# EAGLE design annoyatron_revA (EAGLE 6.5.0)

## Sheet 1 of 2
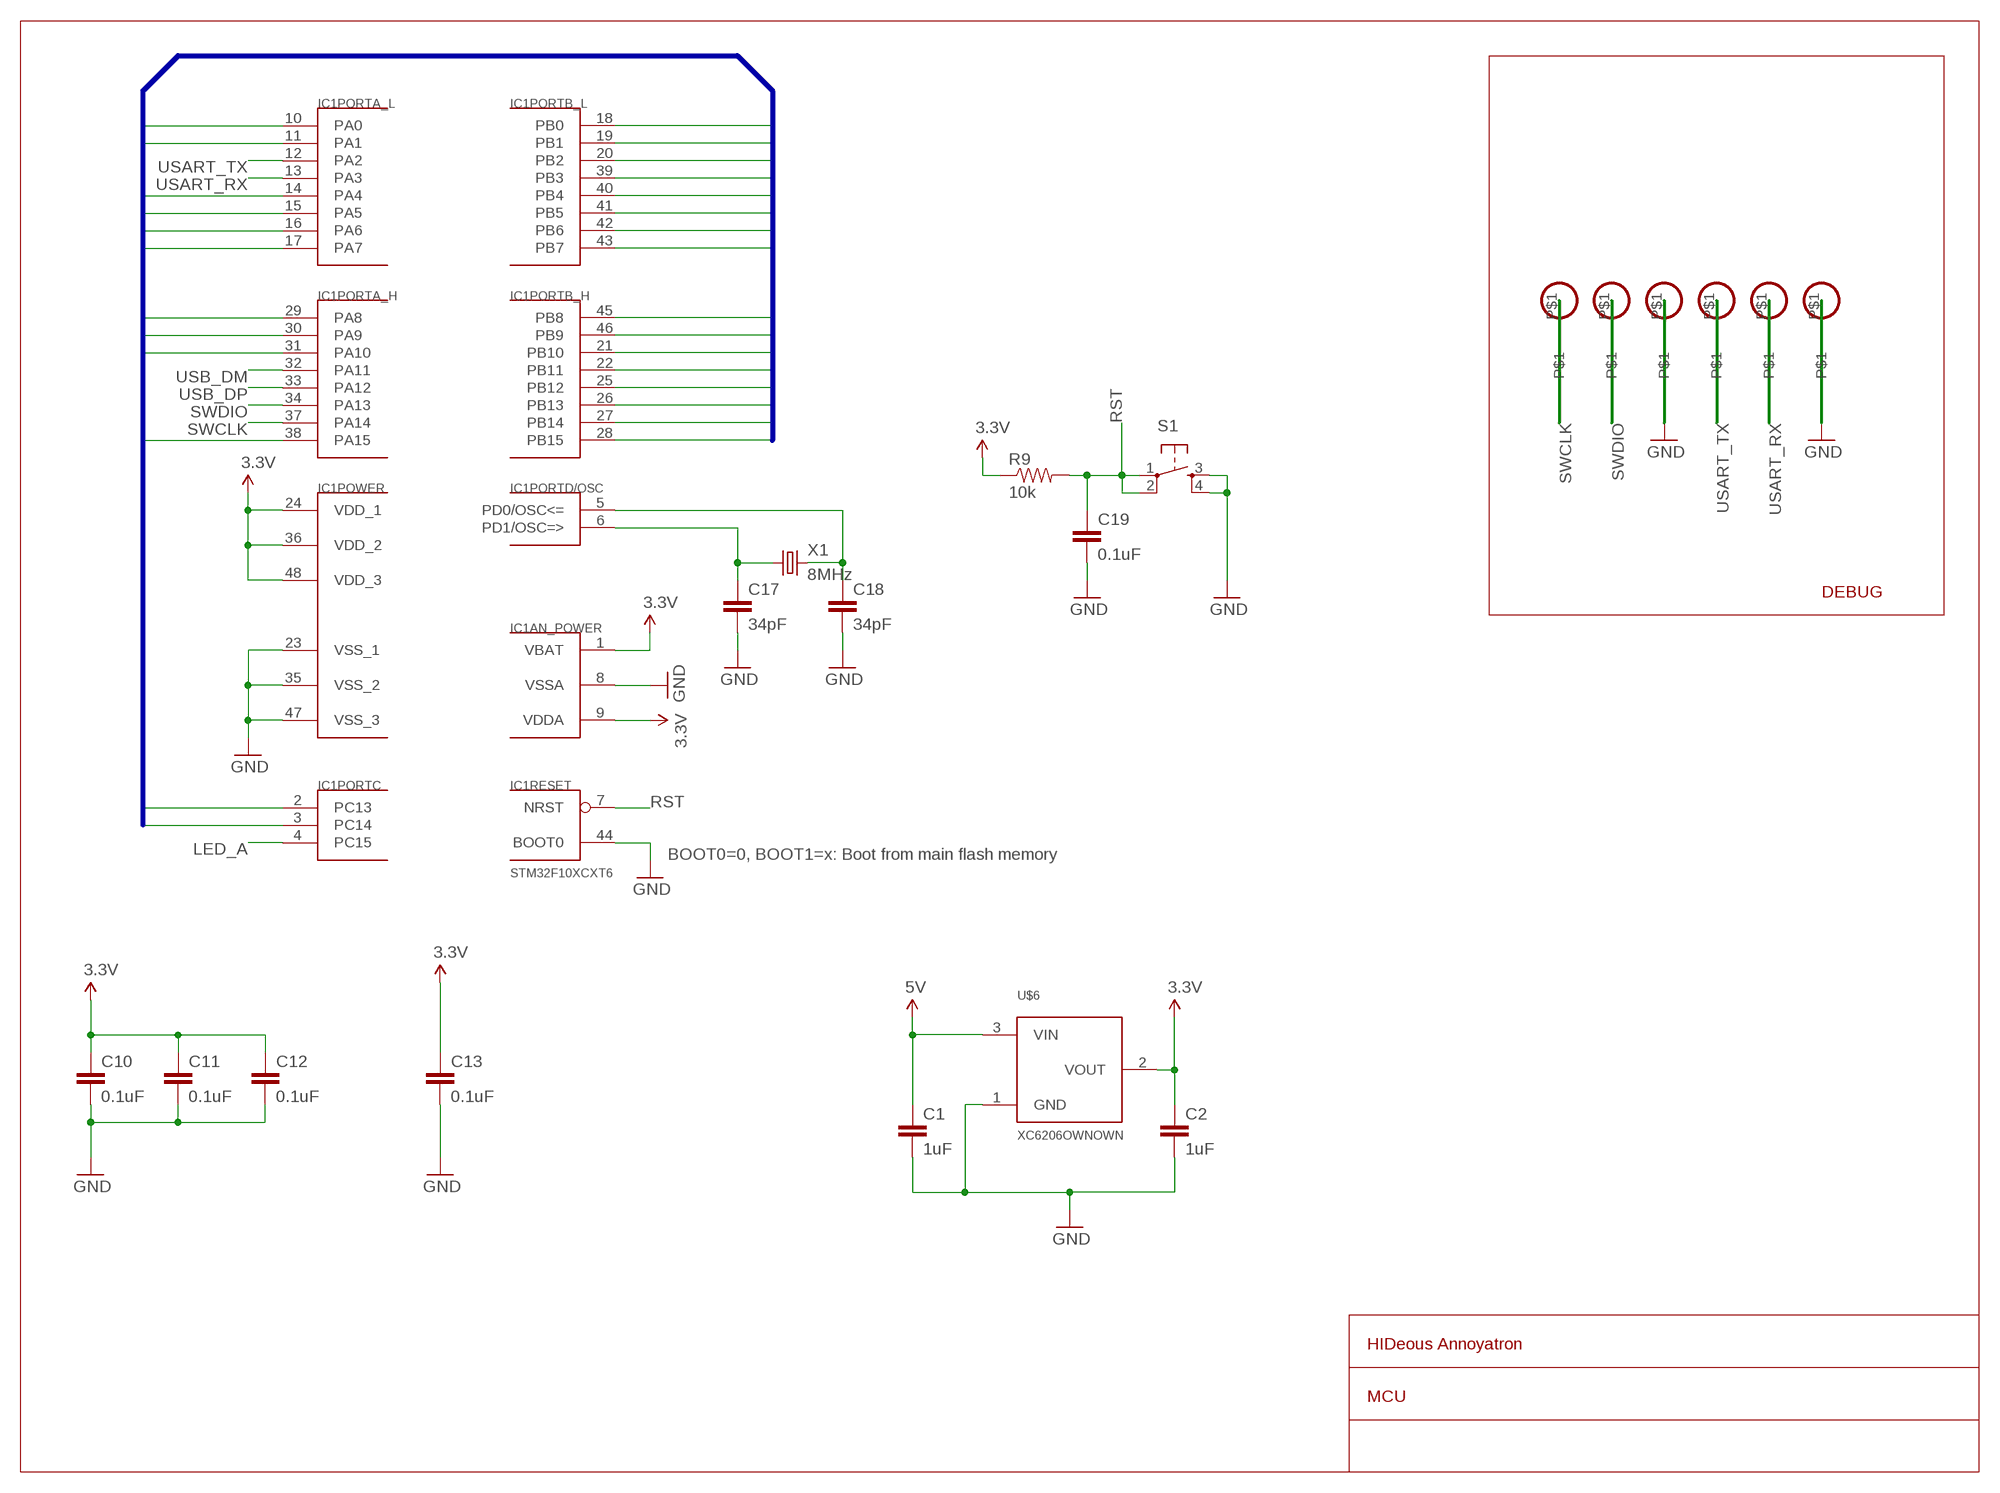
[diagram p0: schematic, sheet 1]

### Parts
C1  1uF  CAP0805  [0805_GEN]
C2  1uF  CAP0805  [0805_GEN]
C10  0.1uF  CAP0402  [C0402]
C11  0.1uF  CAP0402  [C0402]
C12  0.1uF  CAP0402  [C0402]
C13  0.1uF  CAP0402  [C0402]
C17  34pF  CAP0402  [C0402]
C18  34pF  CAP0402  [C0402]
C19  0.1uF  CAP0402  [C0402]
IC1  STM32F10XCXT6  [TQFP48]
R9  10k  RESISTOR0402  [C0402]
S1  TAC_SWITCHSMD  [TACTILE_SWITCH_SMD]
U$2  PADOWN  [PAD2MM]
U$3  PADOWN  [PAD2MM]
U$4  PADOWN  [PAD2MM]
U$5  PADOWN  [PAD2MM]
U$6  XC6206OWNOWN  [SOT23]
U$9  PADOWN  [PAD2MM]
U$10  PADOWN  [PAD2MM]
X1  8MHz  CRYSTALOWN5X3.2_7A  [CRYSTAL_SMD_5X3.2_7A]

### Nets
3.3V: C2.1 C10.1 C11.1 C12.1 C13.1 IC1.1(AN_POWER:VBAT) IC1.9(AN_POWER:VDDA) IC1.24(POWER:VDD_1) IC1.36(POWER:VDD_2) IC1.48(POWER:VDD_3) R9.1 U$6.2(VOUT)
5V: C1.1 U$6.3(VIN) ; also sheet 2
GND: C1.2 C2.2 C10.2 C11.2 C12.2 C13.2 C17.2 C18.2 C19.2 IC1.8(AN_POWER:VSSA) IC1.23(POWER:VSS_1) IC1.35(POWER:VSS_2) IC1.44(RESET:BOOT0) IC1.47(POWER:VSS_3) S1.3 S1.4 U$4.P$1 U$6.1(GND) U$10.P$1 ; also sheet 2
LED_A: IC1.4(PORTC:PC15)
OSCI: C18.1 IC1.5(PORTD/OSC:PD0/OSC<=) X1.P$2
OSCO: C17.1 IC1.6(PORTD/OSC:PD1/OSC=>) X1.P$1
PA0: IC1.10(PORTA_L:PA0)
PA1: IC1.11(PORTA_L:PA1)
PA4: IC1.14(PORTA_L:PA4)
PA5: IC1.15(PORTA_L:PA5)
PA6: IC1.16(PORTA_L:PA6)
PA7: IC1.17(PORTA_L:PA7)
PA8: IC1.29(PORTA_H:PA8) ; also sheet 2
PA9: IC1.30(PORTA_H:PA9)
PA10: IC1.31(PORTA_H:PA10)
PA15: IC1.38(PORTA_H:PA15)
PB0: IC1.18(PORTB_L:PB0)
PB1: IC1.19(PORTB_L:PB1)
PB2: IC1.20(PORTB_L:PB2)
PB3: IC1.39(PORTB_L:PB3)
PB4: IC1.40(PORTB_L:PB4)
PB5: IC1.41(PORTB_L:PB5)
PB6: IC1.42(PORTB_L:PB6)
PB7: IC1.43(PORTB_L:PB7)
PB8: IC1.45(PORTB_H:PB8)
PB9: IC1.46(PORTB_H:PB9)
PB10: IC1.21(PORTB_H:PB10)
PB11: IC1.22(PORTB_H:PB11)
PB12: IC1.25(PORTB_H:PB12)
PB13: IC1.26(PORTB_H:PB13)
PB14: IC1.27(PORTB_H:PB14)
PB15: IC1.28(PORTB_H:PB15)
PC13: IC1.2(PORTC:PC13)
PC14: IC1.3(PORTC:PC14)
RST: C19.1 IC1.7(RESET:NRST) R9.2 S1.1 S1.2
SWCLK: IC1.37(PORTA_H:PA14) U$2.P$1
SWDIO: IC1.34(PORTA_H:PA13) U$3.P$1
USART_RX: IC1.13(PORTA_L:PA3) U$9.P$1
USART_TX: IC1.12(PORTA_L:PA2) U$5.P$1
USB_DM: IC1.32(PORTA_H:PA11) ; also sheet 2
USB_DP: IC1.33(PORTA_H:PA12) ; also sheet 2

### Buses
PA[0..1],PA[4..10],PA15,PB[0..15],PC[13..14]

### Notes on the sheet
- DEBUG
- BOOT0=0, BOOT1=x: Boot from main flash memory
- HIDeous Annoyatron
- MCU

## Sheet 2 of 2
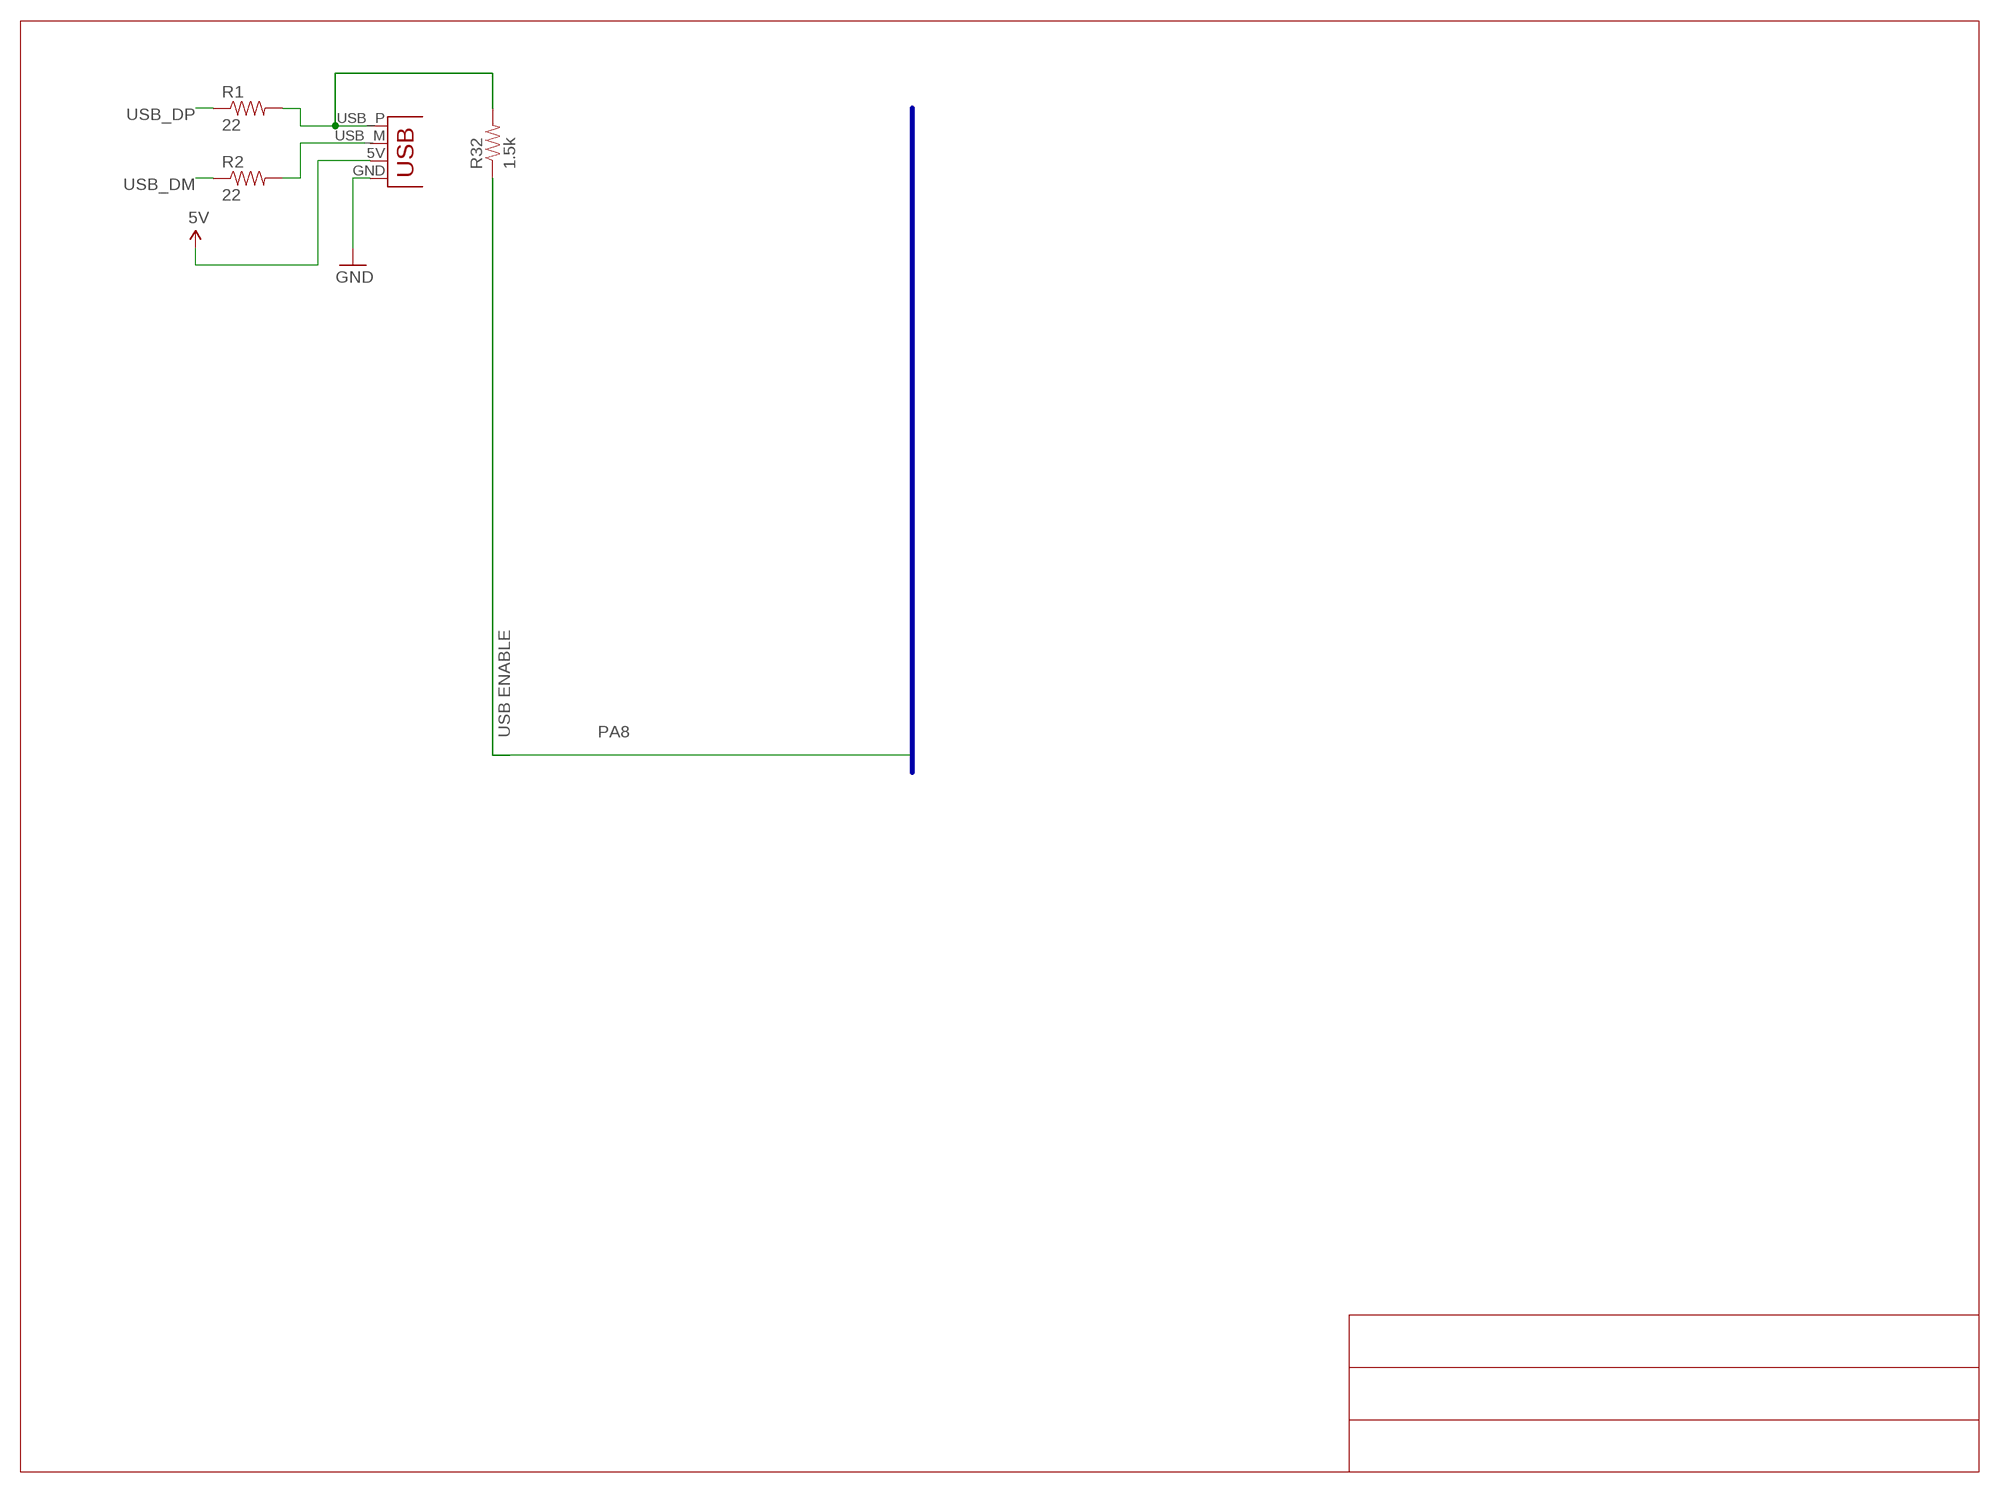
[diagram p1: schematic, sheet 2]

### Parts
JP1  USBPCB  [USB-A-PCB]
R1  22  RESISTOR0402  [C0402]
R2  22  RESISTOR0402  [C0402]
R32  1.5k  RESISTOR0402  [C0402]

### Nets
5V: JP1.5V(VBUS) ; also sheet 1
GND: JP1.GND ; also sheet 1
N$1: JP1.USB_P(D+) R1.2 R32.2
N$2: JP1.USB_M(D-) R2.2
PA8: R32.1 ; also sheet 1
USB_DM: R2.1 ; also sheet 1
USB_DP: R1.1 ; also sheet 1

### Buses
PA[0..1],PA[4..10],PA15,PB[0..15],PC[13..14]

### Notes on the sheet
- USB ENABLE

## Library data of the parts
C1 C2 C10-C13 C17-C19 = robot:CAP: Capacitor Standard 0603 ceramic capacitor, and 0.1" leaded capacitor.
IC1 = stm32:STM32F10XCXT6: ST STM32F101/103 48pin LQFP
JP1 = SparkFun-Connectors:USB: USB Connectors USB-B-PTH is fully proven SKU : PRT-00139/CONN-08278 USB-miniB is fully proven SKU : PRT-00587 USB-A-PCB is untested. USB-A-H is throughly reviewed, but untested. Spark Fun Electronics SKU : PRT-00437 USB-B-SMT is throughly reviewed, but untested. Needs silkscreen touching up. USB-A-S has not been used/tested USB-MB-H has not been used/tested USB-MICROB has been used. CONN-09505
R1 R2 R9 R32 = SparkFunEagle-6-6-07:RESISTOR: Resistor Basic schematic elements and footprints for 0603, 1206, and PTH 1/10th watt (small) resistors.
S1 = SparkFun-Electromechanical:TAC_SWITCH: Momentary Switch Button commonly used for reset or general input. Spark Fun Electronics SKU : COM-00097 SMT- SWCH-08247; PROD_ID: SWCH-08247
U$2-U$5 U$9 U$10 = robot:PAD
U$6 = robot:XC6206
X1 = robot:CRYSTAL: Crystals Various standard crystals. Proven footprints. Spark Fun Electronics SKU : COM-00534

## Board
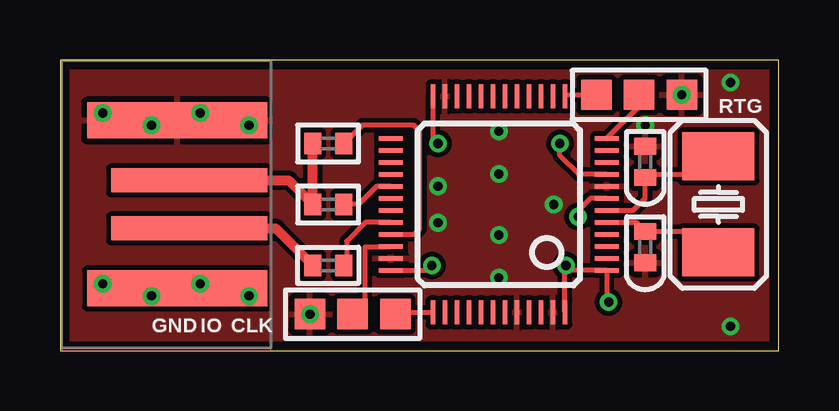
[diagram p2: board, top side]
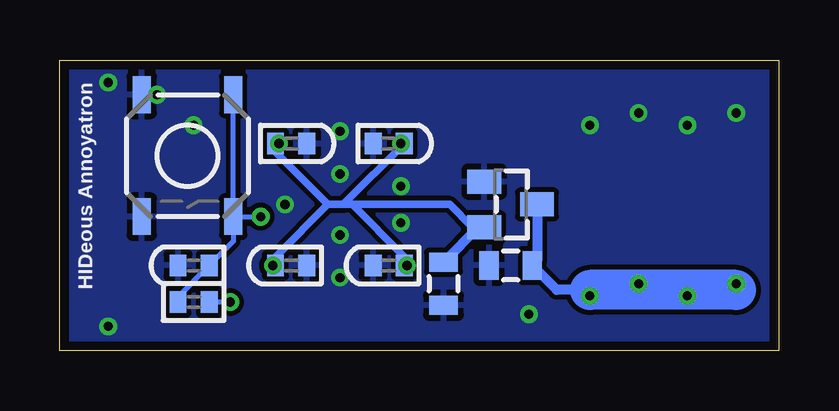
[diagram p3: board, bottom side, seen from below]

Size 29.95 x 12.12 mm. Coordinates in mm from the lower left corner, seen from the top.
Outline: 0,0 29.95,0 29.95,12.12 0,12.12 0,0
Copper layers (1*16): Top 0.0356mm / dielectric 1.5011mm / Bottom 0.0356mm
Design rules "LaenPCBOrder *": minimum track width 6mil, minimum drill 13mil, track to track 6mil, track to pad 6mil, pad to pad 6mil, via to via 6mil, smd to smd 6mil, copper to edge 15mil, drill to drill 6mil, minimum pad ring 7mil, minimum via ring 7mil, stop-mask expansion 3mil, vias tented up to drill 15mil, thermal gap 10mil

### Footprints (pad centres in the part's own frame; a part is rotated, then mirrored left to right if it is on the bottom)
0805_GEN = smd 0.8 x 1.2: 1 -0.9,0; 2 0.9,0
C0402 = smd 0.7 x 0.9: 1 -0.65,0; 2 0.65,0
TQFP48 = smd 0.2 x 1: 1 -2.75,-4.5; 2 -2.25,-4.5; 3 -1.75,-4.5; 4 -1.25,-4.5; 5 -0.75,-4.5; 6 -0.25,-4.5; 7 0.25,-4.5; 8 0.75,-4.5; 9 1.25,-4.5; 10 1.75,-4.5; 11 2.25,-4.5; 12 2.75,-4.5; 25 2.75,4.5; 26 2.25,4.5; 27 1.75,4.5; 28 1.25,4.5; 29 0.75,4.5; 30 0.25,4.5; 31 -0.25,4.5; 32 -0.75,4.5; 33 -1.25,4.5; 34 -1.75,4.5; 35 -2.25,4.5; 36 -2.75,4.5 | smd 1 x 0.2: 13 4.5,-2.75; 14 4.5,-2.25; 15 4.5,-1.75; 16 4.5,-1.25; 17 4.5,-0.75; 18 4.5,-0.25; 19 4.5,0.25; 20 4.5,0.75; 21 4.5,1.25; 22 4.5,1.75; 23 4.5,2.25; 24 4.5,2.75; 37 -4.5,2.75; 38 -4.5,2.25; 39 -4.5,1.75; 40 -4.5,1.25; 41 -4.5,0.75; 42 -4.5,0.25; 43 -4.5,-0.25; 44 -4.5,-0.75; 45 -4.5,-1.25; 46 -4.5,-1.75; 47 -4.5,-2.25; 48 -4.5,-2.75
USB-A-PCB = smd 7.5 x 1.5: 5V -0.2,-3.5; GND -0.2,3.5 | smd 6.5 x 1: USB_M 0.3,-1; USB_P 0.3,1
TACTILE_SWITCH_SMD = smd 1.524 x 0.762: 1 -2.54,1.905; 2 2.54,1.905; 3 -2.54,-1.905; 4 2.54,-1.905
PAD2MM = smd 1.27 x 1.27: P$1 0,0
SOT23 = smd 1 x 1.4: 1 -0.95,-1.1; 2 0.95,-1.1; 3 0,1.1
CRYSTAL_SMD_5X3.2_7A = smd 2 x 3: P$1 -2,0; P$2 2,0

### Placement (x,y rotation side)
C1  11.18,3.56 180 bottom
C2  13.97,2.79 270 bottom
C10  16.26,8.64 180 bottom
C11  20.32,3.56 0 bottom
C12  16.26,3.56 180 bottom
C13  20.32,8.64 0 bottom
C17  24.38,7.87 90 top
C18  24.38,4.32 270 top
C19  24.38,3.56 180 bottom
IC1  18.29,6.1 90 top
JP1  5.08,6.1 0 top
R1  11.18,8.64 180 top
R2  11.18,3.56 180 top
R9  24.38,2.03 180 bottom
R32  11.18,6.1 180 top
S1  24.64,8.13 270 bottom
U$2  13.97,1.52 0 top
U$3  12.19,1.52 0 top
U$4  10.41,1.52 0 top
U$5  24.13,10.67 0 top
U$6  11.18,6.1 270 bottom
U$9  22.35,10.67 0 top
U$10  25.91,10.67 0 top
X1  27.43,6.1 270 top

### Tracks (layer width: path | path; a pad name or v marks a point on that pad's centre or on a via)
3.3V  (via drill 0.38 pad 0.25)
  Top 0.203: IC1.24 15.54,8.85 v15.75,8.64 | IC1.9 21.61,7.35 20.83,8.13 v20.83,8.64 | IC1.48 21.04,3.51 v21.08,3.56 21.29,3.35 IC1.1 22.79,2.1 v22.86,2.03 | IC1.36 15.28,3.35 v15.49,3.56
  Bottom 0.203: C10.1 v15.75,8.64 | C13.1 v20.83,8.64 | C11.1 v21.08,3.56 | C12.1 v15.49,3.56 | v22.86,2.03 R9.1
  Bottom 0.305: 12.52,5.15 12.77,5.15 13.72,6.1 17.78,6.1 | 17.78,6.1 18.15,6.1 | 18.15,6.1 C10.1 | C13.1 20.97,8.27 18.8,6.1 | 18.8,6.1 18.15,6.1 | 18.8,6.1 20.97,3.92 C11.1 | C12.1 15.61,3.92 17.78,6.1
  Bottom 0.406: U$6.2 12.52,5.15 C2.1
5V  (via drill 0.38 pad 0.25)
  Top 0.203: JP1.5V 4.57,2.29 v3.81,2.29
  Bottom 0.203: v1.78,2.79 1.78,2.54 | v3.81,2.29 4.57,2.29 5.08,2.79 v5.84,2.79 7.37,2.79 v7.87,2.29 7.87,2.54
  Bottom 0.406: 7.87,2.54 9.26,2.54 C1.1 10.08,3.76 U$6.3
  Bottom 1.676: 1.78,2.54 7.87,2.54
GND  (via drill 0.38 pad 0.25)
  other vias: 1.78,9.91 3.81,9.4 5.84,9.91 7.87,9.4 24.38,9.4 15.75,5.33 15.75,6.86 18.29,7.37 18.29,4.83 20.57,6.1 25.91,10.67 10.41,1.52 18.29,9.14 18.29,3.05 27.94,1.02 27.94,11.18
  pour Bottom (isolate 0.203): 0,12.29 29.92,12.29 29.92,0 0,0
  pour Top (isolate 0.203): 0,12.29 29.92,12.29 29.92,0 0,0
N$1
  Top 0.406: JP1.USB_P 9.53,7.1 R32.2 R1.2
N$2
  Top 0.406: JP1.USB_M 8.99,5.1 R2.2
OSCI
  Top 0.203: IC1.5 24.01,5.35 C18.1 26.56,4.97 X1.P$2
OSCO
  Top 0.203: IC1.6 23.88,5.85 24.38,6.35 C17.1 24.53,7.37 27.18,7.37 27.43,7.62 X1.P$1
PA8
  Top 0.203: IC1.29 13.2,6.85 12.45,6.1 R32.1
RST  (via drill 0.38 pad 0.25)
  Top 0.203: IC1.7 22.1,6.35 21.59,5.84 v21.59,5.59
  Bottom 0.203: R9.2 25.03,2.26 C19.1 22.73,4.56 S1.2 | S1.2 S1.1 | S1.2 v21.59,5.59
SWCLK
  Top 0.203: U$2.P$1 14.3,1.6 IC1.37
SWDIO
  Top 0.203: IC1.34 13.76,4.32 12.7,4.32 12.7,2.03 U$3.P$1
USART_RX
  Top 0.203: IC1.13 21.11,10.67 U$9.P$1
USART_TX
  Top 0.203: IC1.12 24.13,10.19 U$5.P$1
USB_DM
  Top 0.203: IC1.32 12.71,5.35 11.94,4.57 11.94,3.67 R2.1
USB_DP
  Top 0.203: IC1.33 14.75,4.85 14.99,5.08 14.99,9.14 14.73,9.4 12.59,9.4 R1.1

### Text on the board
_tsilk: RTG | GND | IO | CLK
_bsilk: HIDeous Annoyatron